# Altium schematic sheet DiffProbe.SchDoc: Low Voltage Differential Probe
size A3; Date: 19-SEP-2023; Author: JFOSTER; DrawnBy: JFOSTER; Engineer: JFOSTER; Revision: A; SheetNumber: 1; SheetTotal: 1
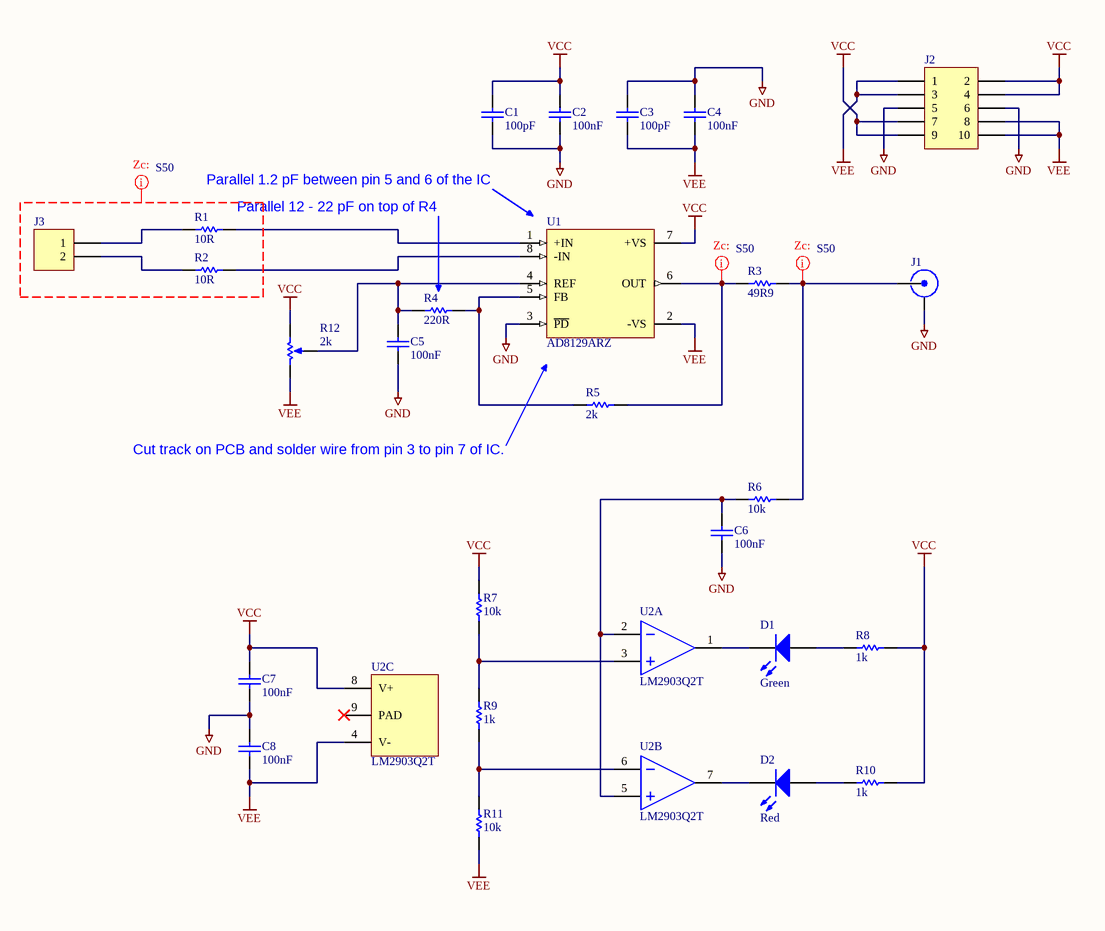
[diagram p0: DiffProbe.SchDoc]

## Parts
C1  100pF  [Cap,SMD,0402]
C2  100nF  [Cap,SMD,0402]
C3  100pF  [Cap,SMD,0402]
C4  100nF  [Cap,SMD,0402]
C5  100nF  [Cap,SMD,0402]
C6  100nF  [Cap,SMD,0402]
C7  100nF  [Cap,SMD,0402]
C8  100nF  [Cap,SMD,0402]
D1  Green  [LED,0603]
D2  Red  [LED,0603]
J1  CON-SMA-EDGE-S  [CONN,SMA,50OHM,EDGE]  (value not drawn)
J2  Term,Header,5x2 Pin,1.27mm,SMD  [TERM,HEADER,5X2PIN,P1.27,SMD]  (value not drawn)
J3  Term,Header,2 Pin,Top,2.54mm  [Term,Header,2Pin,2.54mm]  (value not drawn)
R1  10R  [RES,0402]
R2  10R  [RES,0402]
R3  49R9  [RES,0402]
R4  220R  [RES,0402]
R5  2k  [RES,0402]
R6  10k  [RES,0402]
R7  10k  [RES,0402]
R8  1k  [RES,0402]
R9  1k  [RES,0402]
R10  1k  [RES,0402]
R11  10k  [RES,0402]
R12  2k  [Res,Trim,5T,Top-Adj,SMD]
U1  AD8129ARZ  [IC,SOIC-8,1.27mm,W3.9]
U2  LM2903Q2T  [IC,DFN-8,P0.5,PAD]  (parts A,B,C of 3)

## Nets
GND: C1.1 C2.1 C3.2 C4.2 C5.1 C6.1 C7.1 C8.2 J1.2(GND) J2.5 J2.6 U1.3(~{PD})
VCC: C1.2 C2.2 C7.2 J2.2 J2.4 J2.7 J2.9 R7.2 R8.1 R10.1 R12.3(TOP) U1.7(+VS) U2.8(V+)
VEE: C3.1 C4.1 C8.1 J2.1 J2.3 J2.8 J2.10 R11.1 R12.1(BOT) U1.2(-VS) U2.4(V-)
NetC5_2: C5.2 R4.1 R12.2(TAP) U1.4(REF)
NetC6_2: C6.2 R6.2 U2.2(IN1-) U2.5(IN2+)
NetD1_1: D1.1(A) R8.2
NetD1_2: D1.2(K) U2.1(OUT1)
NetD2_1: D2.1(A) R10.2
NetD2_2: D2.2(K) U2.7(OUT2)
NetJ1_1: J1.1(RF) R3.2 R6.1
NetJ3_1: J3.1 R1.1
NetJ3_2: J3.2 R2.1
NetR1_2: R1.2 U1.1(+IN)
NetR2_2: R2.2 U1.8(-IN)
NetR3_1: R3.1 R5.2 U1.6(OUT)
NetR4_2: R4.2 R5.1 U1.5(FB)
NetR7_1: R7.1 R9.2 U2.3(IN1+)
NetR9_1: R9.1 R11.2 U2.6(IN2-)

Not connected (* = marked no-connect by the designer): U2 9(PAD)*

## Layout directives
net class S50: (no net found under the mark), NetJ1_1, NetR3_1

## Notes on the sheet
- Parallel 1.2 pF between pin 5 and 6 of the IC
- (near R1) Parallel 12 - 22 pF on top of R4
- Cut track on PCB and solder wire from pin 3 to pin 7 of IC.

## Library data of the parts
C1 C3 = CAP,Cer,100pF,50VDC,C0G/NP0,0402: 100pF ±5% 50V Ceramic Capacitor C0G, NP0 0402 (1005 Metric); Vendor Part Number: 490-10669-1-ND; Manufacturer: Murata Electronics; Manufacturer Part Number: GCM1555C1H101JA16D; Vendor: Digikey; HelpURL: https://www.murata.com/~/media/webrenewal/support/library/catalog/products/capacitor/mlcc/c03e.ashx?la=en-us; CreatedBy: Judd Foster
C2 C4-C8 = CAP,Cer,100nF,25VDC,X7R,0402: 0.1µF ±10% 25V Ceramic Capacitor X7R 0402 (1005 Metric); Vendor Part Number: 490-14603-1-ND; Manufacturer: Murata Electronics; Manufacturer Part Number: GRM155R71E104KE14J; Vendor: Digikey; HelpURL: https://search.murata.co.jp/Ceramy/image/img/A01X/G101/ENG/GRM155R71E104KE14-01.pdf; CreatedBy: Judd Foster
D1 = LED,Green,SMD,0603: Green 530nm LED Indication - Discrete 3V 0603 (1608 Metric); Manufacturer: Stanley Electric Co; Manufacturer Part Number: THG1111C-0005-TR; Vendor Part Number: 404-1286-1-ND; Vendor: Digikey; CreatedBy: Judd Foster; HelpURL: http://www.stanley-components.com/php/downloaddatafile.php?rp=0,THG1111C-0005_e.pdf
D2 = LED,Red,SMD,0603: Red 633nm LED Indication - Discrete 2V 0603 (1608 Metric); Manufacturer: Lite-On Inc.; Manufacturer Part Number: LS Q976-NR-1; Vendor Part Number: 475-2512-1-ND; Vendor: Digikey; CreatedBy: Judd Foster; HelpURL: https://dammedia.osram.info/media/resource/hires/osram-dam-6494322/LS%20Q976_EN.pdf
J1 = Conn,RF,SMA,Fem,50R,Edge,SMD: SMA Connector Jack, Female Socket Board Edge, End Launch Solder; Manufacturer: RF Solutions; Vendor Part Number: CON-SMA-EDGE-S-ND; Vendor: DigiKey; CreatedBy: Judd Foster; HelpURL: https://datasheet.lcsc.com/lcsc/2003251910_TE-Connectivity-5-1814832-2_C482015.pdf; Manufacturer Part Number: CON-SMA-EDGE-S
J2 = Term,Header,5x2 Pin,1.27mm,SMD: Connector Header Surface Mount 10 position 0.050" (1.27mm); Vendor Part Number: 609-3695-1-ND; Manufacturer: Amphenol ICC (FCI); Manufacturer Part Number: 20021121-00010C4LF; Vendor: Digikey; HelpURL: https://media.digikey.com/pdf/Data%20Sheets/FCI%20PDFs/Minitek%20127_Catalog.pdf; CreatedBy: Judd Foster
J3 = Term,Header,2 Pin,Top,2.54mm: CONN HEADER VERT 2POS 2.54MM; Vendor: N/A; Vendor Part Number: N/A; HelpURL: N/A; Manufacturer: N/A; Manufacturer Part Number: N/A; Created By: Judd Foster
R1 R2 = RES,10R,1%,0.063W,0402: 10 Ohms ±1% 0.063W, 1/16W Chip Resistor 0402 (1005 Metric) Automotive AEC-Q200 Thick Film; Manufacturer: Panasonic Electronic Components; Manufacturer Part Number: ERJ-2RKF10R0X; Vendor Part Number: P10.0LCT-ND; Vendor: Digikey; CreatedBy: Judd Foster; HelpURL: https://industrial.panasonic.com/cdbs/www-data/pdf/RDA0000/AOA0000C304.pdf
R3 = RES,49R9,1%,0.063W,0402: 49.9 Ohms ±1% 0.063W, 1/16W Chip Resistor 0402 (1005 Metric) Moisture Resistant Thick Film; Manufacturer: Yageo; Manufacturer Part Number: RC0402FR-0749R9L; Vendor Part Number: 311-49.9LRCT-ND; Vendor: Digikey; CreatedBy: Judd Foster; HelpURL: https://www.yageo.com/upload/media/product/productsearch/datasheet/rchip/PYu-RC_Group_51_RoHS_L_10.pdf
R4 = RES,220R,1%,0.063W,0402: 220 Ohms ±1% 0.063W, 1/16W Chip Resistor 0402 (1005 Metric) Moisture Resistant Thick Film; Manufacturer: Yageo; Manufacturer Part Number: RC0402FR-07220RL; Vendor Part Number: 311-220LRCT-ND; Vendor: Digikey; CreatedBy: Judd Foster; HelpURL: https://www.yageo.com/upload/media/product/productsearch/datasheet/rchip/PYu-RC_Group_51_RoHS_L_12.pdf
R5 = RES,2k,1%,0.063W,0402: 2 kOhms ±1% 0.063W, 1/16W Chip Resistor 0402 (1005 Metric) Automotive AEC-Q200 Thick Film; Vendor Part Number: RMCF0402FT2K00CT-ND; Manufacturer: Stackpole Electronics Inc; Manufacturer Part Number: RMCF0402FT2K00; Vendor: DIgikey; HelpURL: https://www.seielect.com/catalog/sei-rmcf_rmcp.pdf; CreatedBy: Judd Foster
R6 R7 R11 = RES,10k,5%,0.063W,0402: 10 kOhms ±5% 0.063W, 1/16W Chip Resistor 0402 (1005 Metric) Automotive AEC-Q200 Thick Film; Vendor Part Number: RMCF0402JT10K0CT-ND; Manufacturer: Stackpole Electronics Inc; Manufacturer Part Number: RMCF0402JT10K0; Vendor: DIgikey; HelpURL: https://www.seielect.com/catalog/sei-rmcf_rmcp.pdf; CreatedBy: Judd Foster
R8-R10 = RES,1k,5%,0.063W,0402: 1 kOhms ±5% 0.063W, 1/16W Chip Resistor 0402 (1005 Metric) Automotive AEC-Q200 Thick Film; Vendor Part Number: RMCF0402JT1K00CT-ND; Manufacturer: Stackpole Electronics Inc; Manufacturer Part Number: RMCF0402JT1K00; Vendor: DIgikey; HelpURL: https://www.seielect.com/catalog/sei-rmcf_rmcp.pdf; CreatedBy: Judd Foster
R12 = RES,Trim,5T,2k,0.75W,Top-Adj,SMD: 0.25W, 1/4W J Lead Surface Mount Trimmer Potentiometer Cermet Turn Top Adjustment; Manufacturer Part Number: 3214W-202ECT-ND; Vendor Part Number: 3214W-1-202E; Manufacturer: Bourns Inc.; Vendor: Digikey; HelpURL: https://www.bourns.com/docs/Product-Datasheets/3214.pdf; CreatedBy: Judd Foster
U1 = AD8129ARZ: Differential Amplifier 1 Circuit 8-SOIC; Manufacturer: Analog Devices Inc.; Vendor Part Number: 505-AD8129ARZ-ND; Vendor: DigiKey; CreatedBy: Judd Foster; HelpURL: https://www.analog.com/media/en/technical-documentation/data-sheets/AD8129_8130.pdf; Manufacturer Part Number: AD8129ARZ
U2 = LM2903Q2T: Comparator Differential CMOS, DTL, ECL, TTL 8-DFN (2x2); Manufacturer: STMicroelectronics; Vendor Part Number: 497-13503-1-ND; Vendor: Digikey; CreatedBy: Judd Foster; HelpURL: https://www.st.com/content/ccc/resource/technical/document/datasheet/44/f7/9d/99/42/20/45/fd/CD00000534.pdf/files/CD00000534.pdf/jcr:content/translations/en.CD00000534.pdf; Manufacturer Part Number: LM2903Q2T